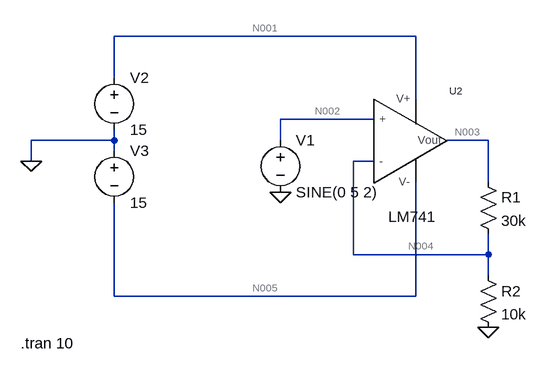
[diagram p0: schematic non inverting amp.asc]
non inverting amp.asc, the LTspice schematic file:
Version 4.1
SHEET 1 880 680
WIRE 256 0 -208 0
WIRE -208 64 -208 0
WIRE 256 96 256 0
WIRE 192 128 48 128
WIRE -208 160 -208 144
WIRE -208 160 -336 160
WIRE 48 160 48 128
WIRE 368 160 304 160
WIRE -208 176 -208 160
WIRE -336 192 -336 160
WIRE 192 192 160 192
WIRE 368 224 368 160
WIRE 160 336 160 192
WIRE 368 336 368 304
WIRE 368 336 160 336
WIRE 368 368 368 336
WIRE -208 400 -208 256
WIRE 256 400 256 224
WIRE 256 400 -208 400
FLAG 368 448 0
FLAG 48 240 0
FLAG -336 192 0
SYMBOL res 352 208 R0
SYMATTR InstName R1
SYMATTR Value 30k
SYMBOL res 352 352 R0
SYMATTR InstName R2
SYMATTR Value 10k
SYMBOL voltage 48 144 R0
WINDOW 123 0 0 Left 0
WINDOW 39 0 0 Left 0
SYMATTR InstName V1
SYMATTR Value SINE(0 5 2)
SYMBOL voltage -208 48 R0
WINDOW 123 0 0 Left 0
WINDOW 39 0 0 Left 0
SYMATTR InstName V2
SYMATTR Value 15
SYMBOL voltage -208 160 R0
WINDOW 123 0 0 Left 0
WINDOW 39 0 0 Left 0
SYMATTR InstName V3
SYMATTR Value 15
SYMBOL LM\ 741\\LM741 240 176 R0
SYMATTR InstName U2
TEXT -352 472 Left 2 !.tran 10

The netlist it stands for:
* non inverting amp.asc
R1 N003 N004 30k
R2 N004 0 10k
V1 N002 0 SINE(0 5 2)
V2 N001 0 15
V3 0 N005 15
X§U2 N002 N004 N001 N005 N003 LM741  ; pins + - V+ V- Vout
.tran 10
.lib C:\Users\Subodha\Desktop\Desk\2nd Semester\Electronics\LT Spices\Unity gain amplifier\LM 741\lm741.lib
.backanno
.end

* Results of the author's LTspice run, read from the files saved beside the schematic
* Operating Point, zero values left out:
*   V(n004) = 1 mV
*   V(n001) = 15 V
*   V(n005) = -15 V
*   V(n003) = 7.056 mV
*   I(V1) = -57.86 nA
*   I(R1) = 201.9 nA
*   I(V3) = -1.701 mA
*   I(R2) = 100 nA
*   I(V2) = -1.701 mA
*   Ix(u2:1) = 57.86 nA
*   Ix(u2:2) = 101.9 nA
*   Ix(u2:99) = 1.701 mA
*   Ix(u2:50) = -1.701 mA
*   Ix(u2:28) = -201.9 nA
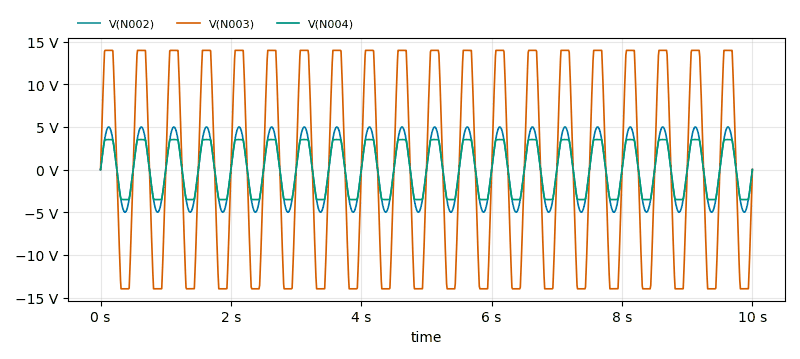
[diagram p1: Transient Analysis of non inverting amp.asc, plotted from the saved traces]
* Transient Analysis, 1 run:
*   V(N002): min -5 V, max 5 V, average 139.4 µV, rms 3.536 V, last 0 V
*   V(N003): min -13.98 V, max 13.98 V, average 3.836 mV, rms 11.59 V, last 6.895 mV
*   V(N004): min -3.519 V, max 3.517 V, average 209.4 µV, rms 2.906 V, last 960.9 µV